# EAGLE design GrblBoard (EAGLE 6.4)
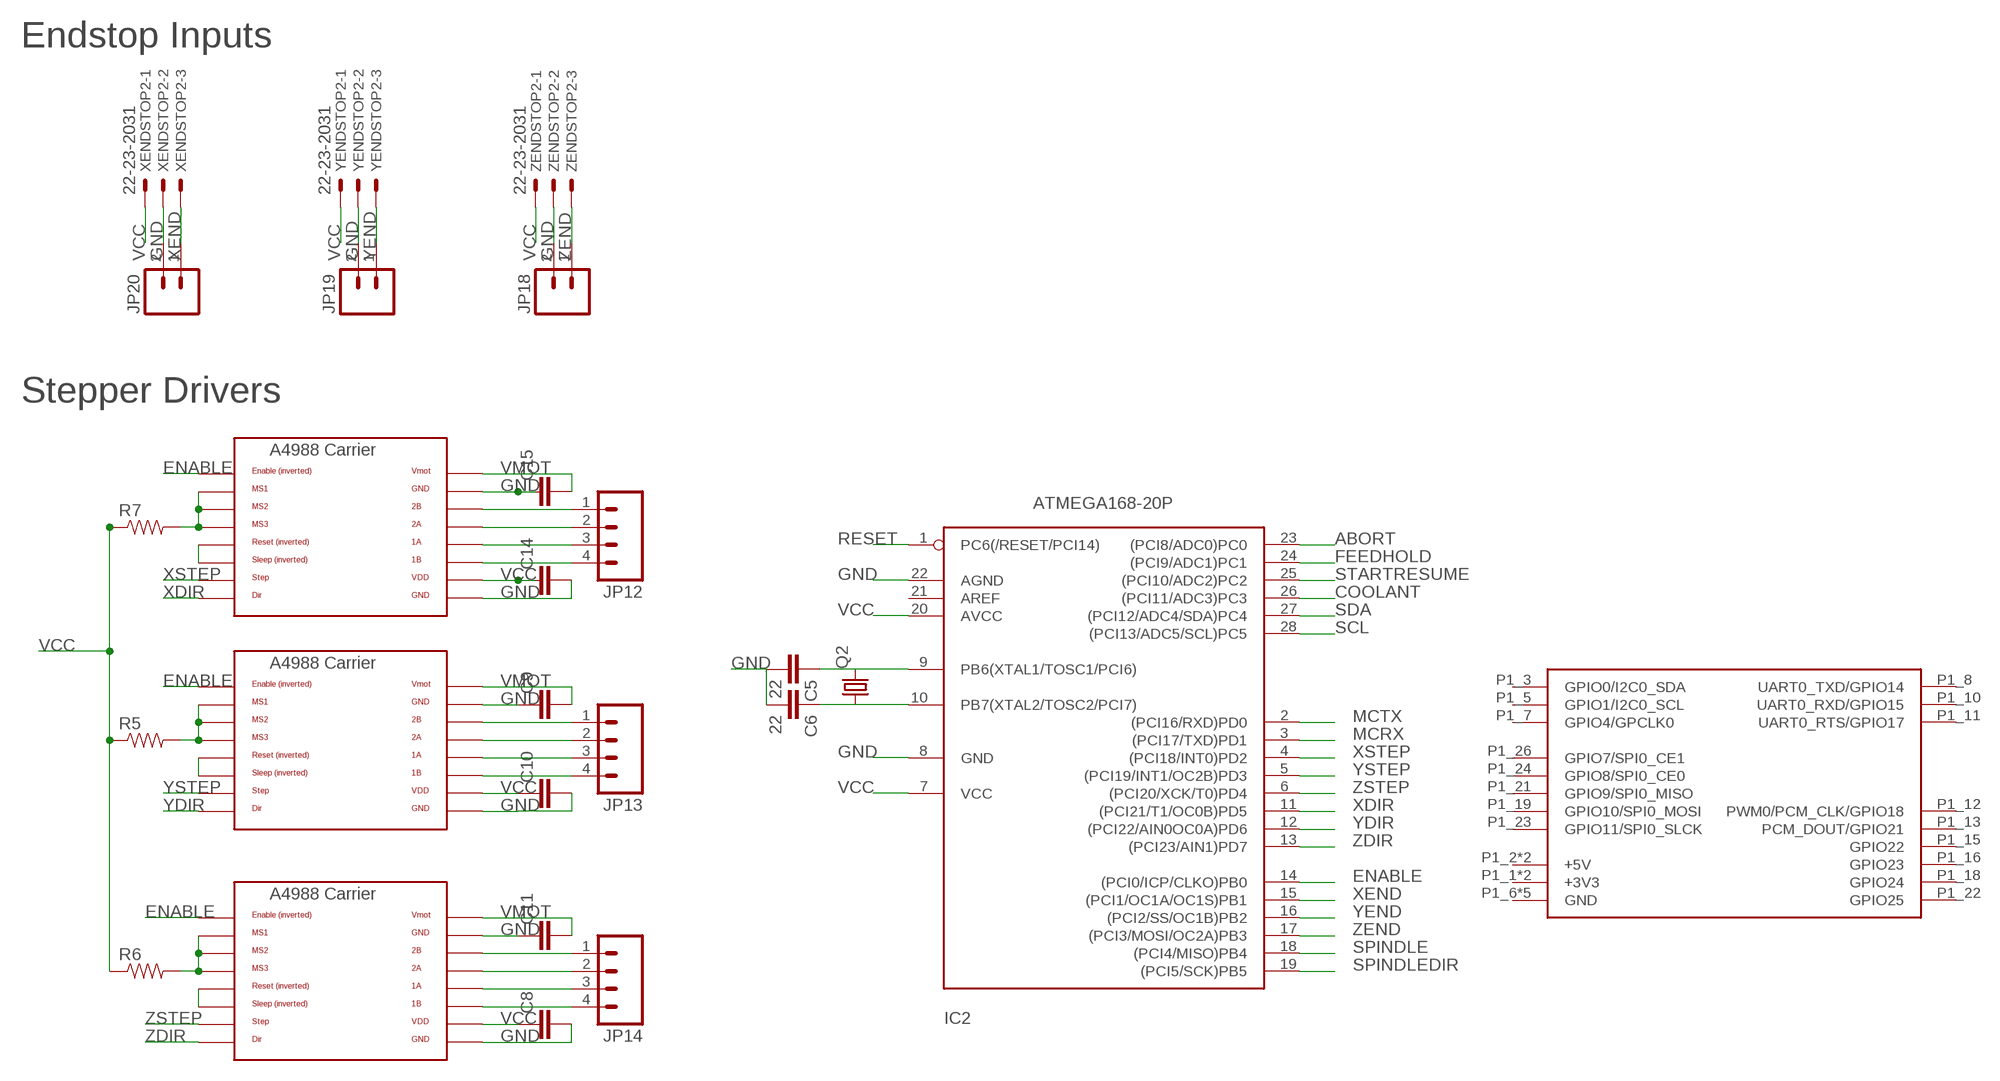
[diagram p0: schematic, sheet 1]

## Parts
C5  22  CAP1206  [1206]
C6  22  CAP1206  [1206]
C8  CAP1206  [1206]
C9  CAP1206  [1206]
C10  CAP1206  [1206]
C11  CAP1206  [1206]
C14  CAP1206  [1206]
C15  CAP1206  [1206]
IC2  ATMEGA168-20P  [DIL28-3]
JP12  M04SCREW  [SCREWTERMINAL-3.5MM-4]
JP13  M04SCREW  [SCREWTERMINAL-3.5MM-4]
JP14  M04SCREW  [SCREWTERMINAL-3.5MM-4]
JP18  M023.5MM  [SCREWTERMINAL-3.5MM-2]
JP19  M023.5MM  [SCREWTERMINAL-3.5MM-2]
JP20  M023.5MM  [SCREWTERMINAL-3.5MM-2]
Q2  CRYSTALHC49UP  [HC49UP]
R5  RESISTOR1206  [1206]
R6  RESISTOR1206  [1206]
R7  RESISTOR1206  [1206]
U$1  RPI-B-V1SHIELD  [RPI-B-V1-SHIELD]
XENDSTOP2  22-23-2031  [22-23-2031]
XPOL  POLOLU_A4983CARRIER  [A4988BREAKOUT]
YENDSTOP2  22-23-2031  [22-23-2031]
YPOL  POLOLU_A4983CARRIER  [A4988BREAKOUT]
ZENDSTOP2  22-23-2031  [22-23-2031]
ZPOL  POLOLU_A4983CARRIER  [A4988BREAKOUT]

## Nets
ABORT: IC2.23((PCI8/ADC0)PC0)
COOLANT: IC2.26((PCI11/ADC3)PC3)
ENABLE: IC2.14((PCI0/ICP/CLKO)PB0) XPOL.EN YPOL.EN ZPOL.EN
FEEDHOLD: IC2.24((PCI9/ADC1)PC1)
GND: C5.2 C6.2 C8.2 C9.1 C10.2 C11.1 C14.2 C15.1 IC2.8(GND) IC2.22(AGND) JP18.2 JP19.2 JP20.2 XENDSTOP2.2 XPOL.GND XPOL.GND@0(GND) YENDSTOP2.2 YPOL.GND YPOL.GND@0(GND) ZENDSTOP2.2 ZPOL.GND ZPOL.GND@0(GND)
MCRX: IC2.3((PCI17/TXD)PD1)
MCTX: IC2.2((PCI16/RXD)PD0)
N$15: ZPOL.RST ZPOL.SLP(SLEEP)
N$16: YPOL.RST YPOL.SLP(SLEEP)
N$17: XPOL.RST XPOL.SLP(SLEEP)
N$18: R7.2 XPOL.MS1 XPOL.MS2 XPOL.MS3
N$19: R5.2 YPOL.MS1 YPOL.MS2 YPOL.MS3
N$21: R6.2 ZPOL.MS1 ZPOL.MS2 ZPOL.MS3
N$26: JP14.4 ZPOL.1B
N$27: JP14.3 ZPOL.1A
N$28: JP14.2 ZPOL.2A
N$29: JP14.1 ZPOL.2B
N$30: JP13.1 YPOL.2B
N$31: JP13.2 YPOL.2A
N$32: JP13.3 YPOL.1A
N$33: JP13.4 YPOL.1B
N$34: JP12.4 XPOL.1B
N$35: JP12.3 XPOL.1A
N$36: JP12.2 XPOL.2A
N$37: JP12.1 XPOL.2B
RESET: IC2.1(PC6(/RESET/PCI14))
SCL: IC2.28((PCI13/ADC5/SCL)PC5)
SDA: IC2.27((PCI12/ADC4/SDA)PC4)
SPINDLE: IC2.18((PCI4/MISO)PB4)
SPINDLEDIR: IC2.19((PCI5/SCK)PB5)
STARTRESUME: IC2.25((PCI10/ADC2)PC2)
VCC: C8.1 C10.1 C14.1 IC2.7(VCC) IC2.20(AVCC) R5.1 R6.1 R7.1 XENDSTOP2.1 XPOL.VDD YENDSTOP2.1 YPOL.VDD ZENDSTOP2.1 ZPOL.VDD
VMOT: C9.2 C11.2 C15.2 XPOL.VMOT YPOL.VMOT ZPOL.VMOT
XDIR: IC2.11((PCI21/T1/OC0B)PD5) XPOL.DIR
XEND: IC2.15((PCI1/OC1A/OC1S)PB1) JP20.1 XENDSTOP2.3
XSTEP: IC2.4((PCI18/INT0)PD2) XPOL.STEP
XTAL1: C5.1 IC2.9(PB6(XTAL1/TOSC1/PCI6)) Q2.2
XTAL2: C6.1 IC2.10(PB7(XTAL2/TOSC2/PCI7)) Q2.1
YDIR: IC2.12((PCI22/AIN0OC0A)PD6) YPOL.DIR
YEND: IC2.16((PCI2/SS/OC1B)PB2) JP19.1 YENDSTOP2.3
YSTEP: IC2.5((PCI19/INT1/OC2B)PD3) YPOL.STEP
ZDIR: IC2.13((PCI23/AIN1)PD7) ZPOL.DIR
ZEND: IC2.17((PCI3/MOSI/OC2A)PB3) JP18.1 ZENDSTOP2.3
ZSTEP: IC2.6((PCI20/XCK/T0)PD4) ZPOL.STEP
Unconnected: IC2.21(AREF) U$1.P1_3(GPIO0/I2C0_SDA) U$1.P1_5(GPIO1/I2C0_SCL) U$1.P1_7(GPIO4/GPCLK0) U$1.P1_8(UART0_TXD/GPIO14) U$1.P1_10(UART0_RXD/GPIO15) U$1.P1_11(UART0_RTS/GPIO17) U$1.P1_12(PWM0/PCM_CLK/GPIO18) U$1.P1_13(PCM_DOUT/GPIO21) U$1.P1_15(GPIO22) U$1.P1_16(GPIO23) U$1.P1_18(GPIO24) U$1.P1_19(GPIO10/SPI0_MOSI) U$1.P1_21(GPIO9/SPI0_MISO) U$1.P1_22(GPIO25) U$1.P1_23(GPIO11/SPI0_SLCK) U$1.P1_24(GPIO8/SPI0_CE0) U$1.P1_26(GPIO7/SPI0_CE1)

## Notes on the sheet
- Endstop Inputs
- Stepper Drivers

## Power pins joined to a net without a drawn wire
+3V3: U$1.P1_1(+3V3) U$1.P1_17(+3V3)
+5V: U$1.P1_2(+5V) U$1.P1_4(+5V)
GND: U$1.P1_6(GND) U$1.P1_9(GND) U$1.P1_14(GND) U$1.P1_20(GND) U$1.P1_25(GND)

## Library data of the parts
C5 C6 C8-C11 C14 C15 = SparkFun-Passives:CAP: Capacitor Standard 0603 ceramic capacitor, and 0.1" leaded capacitor.
IC2 = adafruit:ATMEGA168*P: MICROCONTROLLER 16 kBytes FLASH 1 kBytes SRAM 512 Bytes EEPROM USART 8-channel 10 bit ADC
JP12-JP14 = SparkFun-Connectors:M04: Header 4 Standard 4-pin 0.1" header. Use with straight break away headers (SKU : PRT-00116), right angle break away headers (PRT-00553), swiss pins (PRT-00743), machine pins (PRT-00117), and female headers (PRT-00115). Molex polarized connector foot print use with SKU : PRT-08231 with associated crimp pins and housings. 1MM SMD Version SKU: PRT-10208
JP18-JP20 = SparkFun-Connectors:M02: Header 2 Standard 2-pin 0.1" header. Use with straight break away headers (SKU : PRT-00116), right angle break away headers (PRT-00553), swiss pins (PRT-00743), machine pins (PRT-00117), and female headers (PRT-00115). Molex polarized connector foot print use with SKU : PRT-08233 with associated crimp pins and housings.
Q2 = adafruit:CRYSTAL: CRYSTAL; OC_FARNELL: unknown; OC_NEWARK: unknown
R5-R7 = SparkFun-Passives:RESISTOR: Resistor Basic schematic elements and footprints for 0603, 1206, and PTH resistors.
U$1 = raspberry:RPI-B-V1: First revision of the Model B board without P5 and P6 headers and mounting holes. Choose the "SHIELD" variant for a predefined Dimension layer.
XENDSTOP2 YENDSTOP2 ZENDSTOP2 = con-molex:22-23-2031: .100" (2.54mm) Center Header - 3 Pin; MF: MOLEX; MPN: 22-23-2031; OC_FARNELL: 1462950; OC_NEWARK: 30C0862
XPOL YPOL ZPOL = RepRapjr:POLOLU_A4983CARRIER

## Board
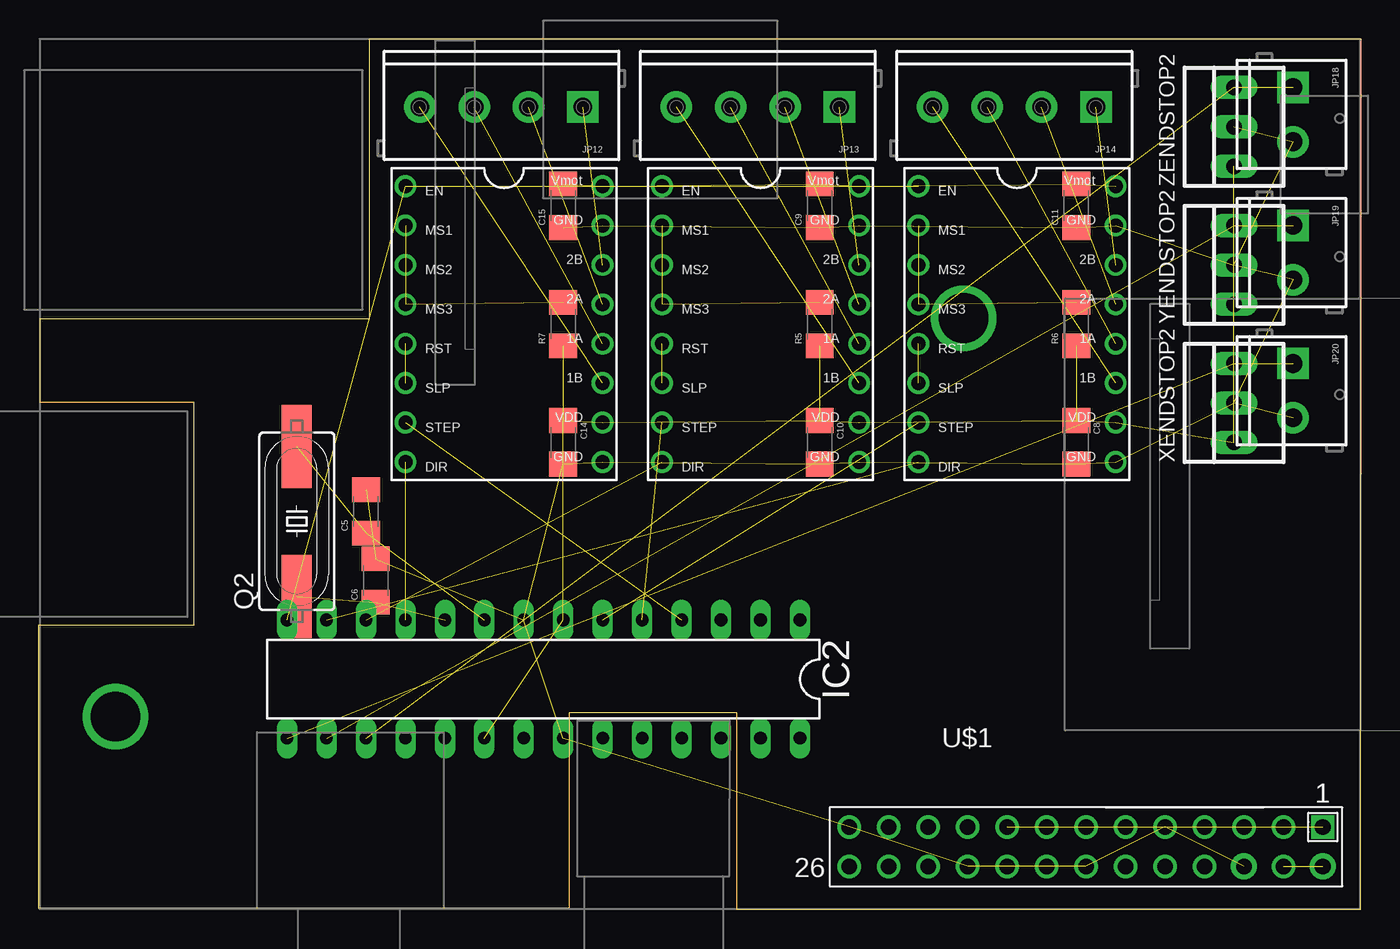
[diagram p1: board, top side]

Size 85.09 x 56.08 mm. Coordinates in mm from the lower left corner, seen from the top.
Copper layers (1*16): Top 0.035mm / dielectric 1.5mm / Bottom 0.035mm
Design rules "default": minimum track width 10mil, minimum drill 24mil, track to track 8mil, track to pad 8mil, pad to pad 8mil, via to via 8mil, smd to smd 8mil, copper to edge 40mil, drill to drill 8mil, minimum pad ring 10mil, minimum via ring 8mil, stop-mask expansion 4mil, vias tented up to drill 0mil, thermal gap 10mil

### Footprints (pad centres in the part's own frame; a part is rotated, then mirrored left to right if it is on the bottom)
1206 = smd 1.6 x 1.8: 1 -1.4,0; 2 1.4,0
DIL28-3 = drill 0.813 long: 1 -16.51,-3.81; 2 -13.97,-3.81; 3 -11.43,-3.81; 4 -8.89,-3.81; 5 -6.35,-3.81; 6 -3.81,-3.81; 7 -1.27,-3.81; 8 1.27,-3.81; 9 3.81,-3.81; 10 6.35,-3.81; 11 8.89,-3.81; 12 11.43,-3.81; 13 13.97,-3.81; 14 16.51,-3.81; 15 16.51,3.81; 16 13.97,3.81; 17 11.43,3.81; 18 8.89,3.81; 19 6.35,3.81; 20 3.81,3.81; 21 1.27,3.81; 22 -1.27,3.81; 23 -3.81,3.81; 24 -6.35,3.81; 25 -8.89,3.81; 26 -11.43,3.81; 27 -13.97,3.81; 28 -16.51,3.81
SCREWTERMINAL-3.5MM-4 = drill 1.2 pad 2.032 square: 1 0,0 | drill 1.2 pad 2.032: 2 3.5,0; 3 7,0; 4 10.5,0
SCREWTERMINAL-3.5MM-2 = drill 1.2 pad 2.032 square: 1 0,0 | drill 1.2 pad 2.032: 2 3.5,0
HC49UP = smd 5.334 x 1.93: 1 -4.826,0; 2 4.826,0
RPI-B-V1-SHIELD = drill 1 square: P1_1 0,0 | drill 1 pad 1.676: P1_2 0,2.54; P1_6 5.08,2.54 | drill 1: P1_3 2.54,0; P1_4 2.54,2.54; P1_5 5.08,0; P1_7 7.62,0; P1_8 7.62,2.54; P1_9 10.16,0; P1_10 10.16,2.54; P1_11 12.7,0; P1_12 12.7,2.54; P1_13 15.24,0; P1_14 15.24,2.54; P1_15 17.78,0; P1_16 17.78,2.54; P1_17 20.32,0; P1_18 20.32,2.54; P1_19 22.86,0; P1_20 22.86,2.54; P1_21 25.4,0; P1_22 25.4,2.54; P1_23 27.94,0; P1_24 27.94,2.54; P1_25 30.48,0; P1_26 30.48,2.54
22-23-2031 = drill 1 long: 1 -2.54,0; 2 0,0; 3 2.54,0
A4988BREAKOUT = drill 0.9: 1A 8.89,1.27; 1B 11.43,1.27; 2A 6.35,1.27; 2B 3.81,1.27; DIR 16.51,-11.43; EN -1.27,-11.43; GND 16.51,1.27; GND@0 1.27,1.27; MS1 1.27,-11.43; MS2 3.81,-11.43; MS3 6.35,-11.43; RST 8.89,-11.43; SLP 11.43,-11.43; STEP 13.97,-11.43; VDD 13.97,1.27; VMOT -1.27,1.27

### Placement (x,y rotation side)
C5  21.06,25.65 90 top
C6  21.69,21.21 90 top
C8  66.78,30.1 270 top
C9  50.27,45.34 90 top
C10  50.27,30.1 270 top
C11  66.78,45.34 90 top
C14  33.76,30.1 270 top
C15  33.76,45.34 90 top
IC2  32.49,14.86 180 top
JP12  35.03,51.69 180 top
JP13  51.54,51.69 180 top
JP14  68.05,51.69 180 top
JP18  80.75,52.96 270 top
JP19  80.75,44.07 270 top
JP20  80.75,35.18 270 top
Q2  16.61,25.02 90 top
R5  50.27,37.72 90 top
R6  66.78,37.72 90 top
R7  33.76,37.72 90 top
U$1  82.65,5.33 180 top
XENDSTOP2  76.94,32.64 90 top
XPOL  35.03,45.34 270 top
YENDSTOP2  76.94,41.53 90 top
YPOL  51.54,45.34 270 top
ZENDSTOP2  76.94,50.42 90 top
ZPOL  68.05,45.34 270 top

### Tracks (layer width: path | path; a pad name or v marks a point on that pad's centre or on a via)
+3V3  (1 unrouted)
+5V  (1 unrouted)
ENABLE  (3 unrouted)
GND  (26 unrouted)
N$1  (via drill 3.2 pad 2.54)
  other vias: 59.54,38.1
N$2  (via drill 3.2 pad 2.54)
  other vias: 4.93,12.45
N$15  (1 unrouted)
N$16  (1 unrouted)
N$17  (1 unrouted)
N$18  (3 unrouted)
N$19  (3 unrouted)
N$21  (3 unrouted)
N$26  (1 unrouted)
N$27  (1 unrouted)
N$28  (1 unrouted)
N$29  (1 unrouted)
N$30  (1 unrouted)
N$31  (1 unrouted)
N$32  (1 unrouted)
N$33  (1 unrouted)
N$34  (1 unrouted)
N$35  (1 unrouted)
N$36  (1 unrouted)
N$37  (1 unrouted)
VCC  (13 unrouted)
VMOT  (5 unrouted)
XDIR  (1 unrouted)
XEND  (2 unrouted)
XSTEP  (1 unrouted)
XTAL1  (2 unrouted)
XTAL2  (2 unrouted)
YDIR  (1 unrouted)
YEND  (2 unrouted)
YSTEP  (1 unrouted)
ZDIR  (1 unrouted)
ZEND  (2 unrouted)
ZSTEP  (1 unrouted)